# Altium schematic sheet relaytimer.SchDoc
size A; SheetNumber: 1; SheetTotal: 1
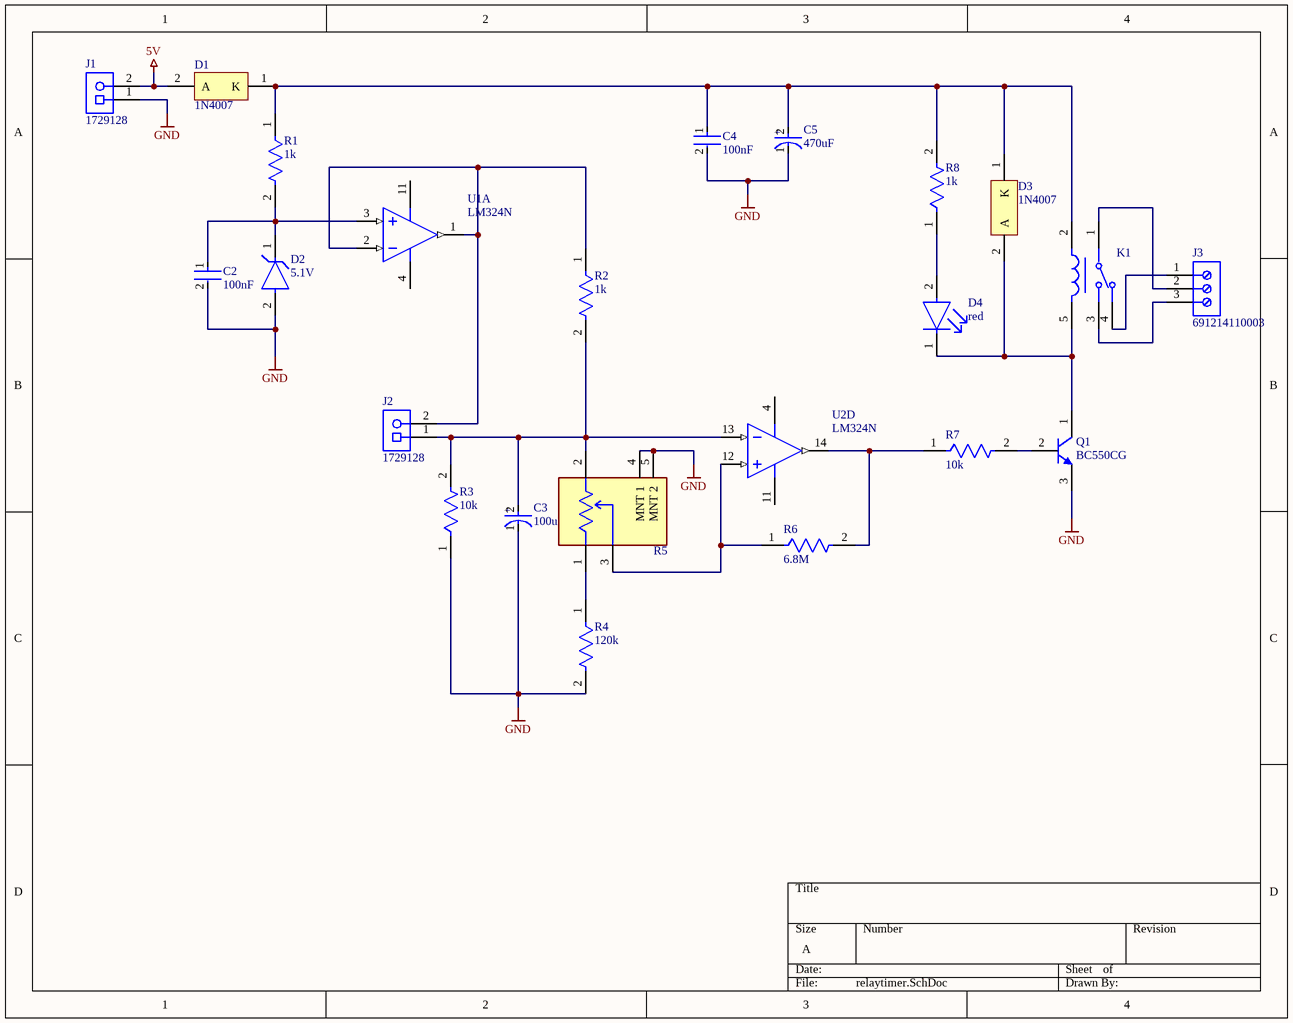
[diagram p0: relaytimer.SchDoc]

## Parts
C2  100nF  [FP-RCE0K1-MFG]
C3  100uF  [FP-OS-CON-TH-C6-d_0_45-MFG]
C4  100nF  [FP-RCE0K1-MFG]
C5  470uF  [FP-OS-CON-TH-C6-d_0_45-MFG]
D1  1N4007  [ONSC-AXIAL_LEAD-2-59-10_P]
D2  5.1V  [FP-017AG-MFG]
D3  1N4007  [ONSC-AXIAL_LEAD-2-59-10_P]
D4  red  [FP-HLMP-1719-MFG]
J1  1729128  [PHOE-1729128-2_V]
J2  1729128  [PHOE-1729128-2_V]
J3  691214110003  [691214110003]
K1  JS1-5V-F  [FP-JS1-5V-F-MFG]  (value not drawn)
Q1  BC550CG  [ONSC-TO-92-3-29-11]
R1  1k  [FP-MRS25-MFG]
R2  1k  [FP-MRS25-MFG]
R3  10k  [FP-MRS25-MFG]
R4  120k  [FP-MRS25-MFG]
R5  PTV09A-4020F-A203  [FP-PTV09A-4020-MFG]  (value not drawn)
R6  6.8M  [FP-MRS25-MFG]
R7  10k  [FP-MRS25-MFG]
R8  1k  [FP-MRS25-MFG]
U1  LM324N  [N0014A]  (part A of 4)
U2  LM324N  [N0014A]  (part D of 4)

## Nets
5V: D1.2(A) J1.2
GND: C2.2 C3.1(C) C4.2 C5.1(C) D2.2(A) J1.1 Q1.3(E) R3.1 R4.2 R5.4(MNT_1) R5.5(MNT_2)
NetC2_1: C2.1 D2.1(C) R1.2 U1.3(IN1+)
NetC3_2: C3.2(A) J2.1 R2.2 R3.2 R5.2 U2.13(IN4-)
NetC4_1: C4.1 C5.2(A) D1.1(K) D3.1(K) K1.2(1_COIL) R1.1 R8.2
NetD3_2: D3.2(A) D4.1(C) K1.5(2_COIL) Q1.1(C)
NetD4_2: D4.2(A) R8.1
NetJ2_2: J2.2 R2.1 U1.1(OUT1) U1.2(IN1-)
NetJ3_1: J3.1 K1.4(N.C.)
NetJ3_2: J3.2 K1.1(COM)
NetJ3_3: J3.3 K1.3(N.O.)
NetQ1_2: Q1.2(B) R7.2
NetR4_1: R4.1 R5.1
NetR5_3: R5.3 R6.1 U2.12(IN4+)
NetR6_2: R6.2 R7.1 U2.14(OUT4)

Not connected (* = marked no-connect by the designer): U1 4(V+) 11(GND); U2 4(V+) 11(GND)

## Notes on the sheet
- (in symbol CMP-05428-000575-1) +

## Library data of the parts
C2 C4 = CMP-06035-058483-1: Cap Ceramic 100nF 50V X7R ±10% Radial 5mm +125°C Automotive Bulk; Lead Diameter: 0.5mm; Lead/Base Style: Formed Leads; Lead Free: Lead Free; Length: 3.6mm; Voltage: 50V; Ratings: AEC-Q200; Termination: Radial; Capacitance: 100nF; Height - Seated (Max): 0.138inch; Voltage Rating: 50V; Voltage Rating (DC): 50V; Height: 3.5mm; Min Operating Temperature: -55°C; Mount: Through Hole; Package Quantity: 500; Depth: 2.5mm; Width: 0.098inch; Lead Pitch: 0.197inch; Dielectric: X7R; Max Operating Temperature: 125°C; Case/Package: Radial; Packaging: Bulk; Tolerance: 10%; Resistor Type: Ceramic
C3 = CMP-05428-000575-1: Conductive Polymer Aluminum Solid Capacitors (OS-CON) 100uF ±20% 16V RADIAL TH 6.3x6mm; Polarity: Polar; Ripple Current: 2.49A; Lead Diameter: 0.45mm; Dissipation Factor: 12%; Life (Hours): 5000Hour; Leakage Current: 280uA; ESR (Equivalent Series Resistance): 24mR; Capacitance: 100uF; Min Operating Temperature: -55°C; Packaging: Bulk; Voltage Rating (DC): 16V; Mount: Through Hole; Number of Pins: 6; Series: OS-CON™, SEPC; Height: 6mm; Radiation Hardening: No; Lead Free: Lead Free; RoHS Compliant: Yes; REACH SVHC: No SVHC; Height - Seated (Max): 0.236inch; Voltage: 16V; Package Quantity: 500; Case/Package: Radial; Lead Pitch: 2.5mm; Diameter: 6.3mm; Tolerance: 20%; Length: 6mm; Construction: RADIAL; Max Operating Temperature: 105°C; Voltage Rating: 16V; Termination: Radial
C5 = CMP-05428-000575-1: Conductive Polymer Aluminum Solid Capacitors (OS-CON) 470uF ±20% 16V RADIAL TH 6.3x6mm; Polarity: Polar; Ripple Current: 2.49A; Lead Diameter: 0.45mm; Dissipation Factor: 12%; Life (Hours): 5000Hour; Leakage Current: 280uA; ESR (Equivalent Series Resistance): 24mR; Capacitance: 470uF; Min Operating Temperature: -55°C; Packaging: Bulk; Voltage Rating (DC): 16V; Mount: Through Hole; Number of Pins: 6; Series: OS-CON™, SEPC; Height: 6mm; Radiation Hardening: No; Lead Free: Lead Free; RoHS Compliant: Yes; REACH SVHC: No SVHC; Height - Seated (Max): 0.236inch; Voltage: 16V; Package Quantity: 500; Case/Package: Radial; Lead Pitch: 2.5mm; Diameter: 6.3mm; Tolerance: 20%; Length: 6mm; Construction: RADIAL; Max Operating Temperature: 105°C; Voltage Rating: 16V; Termination: Radial
D1 D3 = CMP-0902-00142-1: Standard Recovery Rectifier, 2-Pin Axial_Lead, Pb-Free, Bulk Bag; Manufacturer: On Semiconductor; IO(rec) Max (A): 1; IFSM Max (A): 30; VRRM Max (V): 1000; ComponentLink3URL: http://www.onsemi.cn/pub_link/Collateral/59-10.PDF; PackageVersion: Rev. U, 02/2005; PackageDescription: 2-Pin, Axial Lead, Diameter 2.35 mm; PackageReference: AXIAL_LEAD-2-59-10; RoHS: TRUE; PartNumber: 1N4007; Packing: Bulk Bag; DatasheetVersion: Rev. 13; ComponentLink3Description: Package Specification; ComponentLink1Description: Manufacturer URL; ComponentLink2URL: http://www.onsemi.com/pub_link/Collateral/1N4001-D.PDF; ComponentLink1URL: http://www.onsemi.com/; Type: Standard Recovery; ComponentLink2Description: Datasheet; Mounting Technology: Through Hole
D2 = CMP-00278-84409037-1: BZX79C3V3 BZX79C Series 500 mW 5.1 V 100 mA Through Hole Zener Diode - DO-35; Manufacturer Lifecycle Status: ACTIVE; Peak Reverse Current: 25µA; Capacitance: 200pF; Max Junction Temperature (Tj): 200°C; Power Rating: 500mW; Zener Current: 5mA; Forward Voltage: 1.5V; Voltage Tolerance: 5%; Breakdown Voltage: 3.3V; Reverse Voltage: 1V; Element Configuration: Single; Tolerance: 6%; ESD Protection: No; Impedance: 95Ω; REACH SVHC: No SVHC; Schedule B: 8541100050, 8541100050; NexarPartId: 84409037; Weight: 80g; Power Dissipation: 500mW; Max Reverse Leakage Current: 25µA; Length: 4.56mm; Zener Voltage: 3.3V; RoHS: Compliant; Number of Pins: 2; Width: 6.35mm; Lifecycle Status: Production; Height: 1.91mm; Contact Plating: Tin; Diameter: 1.91mm; Max Power Dissipation: 500mW; Test Current: 5mA; Lead Free: Lead Free; Voltage Rating (DC): 3.3V; Max Operating Temperature: 200°C; Mount: Through Hole; Min Operating Temperature: -65°C; Packaging: Bulk; Working Voltage: 3.3V
D4 = CMP-2000-06410-2: LED RED / DIFFUSED T-1 T/H; Manufacturer: Broadcom; Wavelength: 585nm; Led Orientation: Straight; Luminous Intensity: 2.1mcd; Forward Voltage: 1.8V; Viewing Angle: 50°; Colour: Yellow; Description: LED Uni-Color Yellow 2-Pin T-1; Reverse Voltage: 5V; Power Dissipation: 17.5mW; Forward Current: 2mA; Lead Free: Yes; Automotive: No; Device Class L1: Optoelectronics; Mouser Description: Standard LEDs - Through Hole Yellow Diffused 585nm 2.1mcd; Digikey Description: LED YELLOW DIFFUSED T-1 T/H; Temperature: -40°C to +100°C; Temperature Range High: +100°C; Package: 0; Category: Diode; Device Class L2: LEDs; ComponentLink2Description: Datasheet; ComponentLink2URL: https://docs.broadcom.com/docs/AV02-1557EN; Temperature Range Low: -40°C; Device Class L3: unset; Octopart: https://octopart.com/hlmp-1719-broadcom-71130405; RoHS: TRUE; Manufacturer Part Number: HLMP-1719
J1 J2 = CMP-2000-05815-1: PCB Terminal Block, 13.5 A, 400 V, 2-Pin THD, RoHS, Bulk; Manufacturer: Phoenix Contact; Package Version: 03/2015; No. of Rows: 1; Pitch: 5.08mm; No. of Positions: 2; Voltage Rating: 400V; Current Rating: 13500mA; Manufacturer URL: http://www.phoenixcontact.com/; Datasheet URL: https://datasheet.ciiva.com/16046/1729128-16046181.pdf; RoHS: TRUE; Package URL: https://www.phoenixcontact.com/online/portal/pi/pxc/product_detail_page/!ut/p/b1/3VdJjqNKFDxLH8AFycySyWY2ozFsEPOMMQaDOX1XedGL_1Vdm5YXJleknhSKeBkvI6EA8ncAo3AYoDhBQGco6KN7VURTdemj9us_IEKEZo_YHiPAEWEFmDGOHMORkqKYCORBZxgL7ZoaZYcbFFUZ3fqxSY6GOuxydWUuHqz1ynmMFygu583Bob0Ewr6Sd_l-5m-kAueHiB0jpRwZwe58wwtkpxtMYd_LmGcDRU02dRNEyWt6Y2ti5pSyJ_reIkzIulrqApdnbT11V5jnCKbYNCvhEM1MCpPByat_X379-iThf08CI5GfOPqfBeS3BRoBOdD55AKVv0iLwCMq-2BrzXWSGRH7pUGD9uwXQjiph3xL0DKQwdGa0JImiIOmBNOestqgwTHSSs2oOep-78apyXQBvNi8ZLaFjvjWvcaUEBu0MC6Wbe-d6mB0FAebo2lUWinqYaZs5DAYzV0RP9yitUjnGJ0iI9xhZkT42OCQNUJJhkgWINNQLP2JFP6OpMg3JCVg70jqHT0lvKOnhHf0lPuOnnLf0VPuWx6_dxwUIvwk5WMkT0kLL1mh61l2yZVSzG3pYV_bqo-mj6uMKwKwdnnW8Jh5RTOJzMOA5c-eJDaZQw4mTMPH02PvS_ZAqNVjVTo2WyYLkwH_KU1mmmG5kjRhDqPXLwwVHvVOjCM60-fpXvTDfMGW1PVFVS1r4e4yVDk4ZdNbkUHvqPqQSeian4UD39fNKmachqdJ1NJbyk8rXT9mXTvPk3oE5meulKGgiruPJek-4I9hTT6G8ZLOyRSm2RRVbThERQad5OS28hdt4YW4vG0stgYYzsWsK4_7y6DZMjJSCqri1kyiZR5vD7pwIrNR7QwPHTcLTI5qT7eRlpHrdGiupYlqQDJ7zy_CND8fWWBoLRXxk1RVcXiBQwbTD4Xi7KL-FuO94t9xaqweXzH; PartNumber: 1729128; Package Description: 2-Pin Through Hole Device, Body 8.1 x 10.16 mm, Pitch 5.08 mm; Datasheet Version: 12/2013; Mounting Technology: ThroughHole; Orientation: Horizontal; Package Reference: 1729128-2; Packing: Bulk
J3 = CMP-1502-02466-2: NexarPartId: 18818289; Number of Levels: 1; Voltage: 300V; Pitch: 3.5052mm; Stripping Length: -6mm; Number of Positions Per Level: 3; Plating: Brass, Steel; Wire/Cable Gauge: 24AWG; Wire Gauge (Min): 16AWG; Current Rating: 10A; Width: 10.9mm; Length: 7.4mm; Housing Material: Nylon; Height: 12.2mm; Min Operating Temperature: -40°C; Contact Plating: Brass, Tin; Packaging: Box; Color: Blue, Green; Number of Contacts: 3; Number of Pins: 3; Voltage Rating: 300V; Termination: Screw; Lead Pitch: 3.5mm; Max Operating Temperature: 105°C; Mount: Through Hole; Contact Material: Brass; RoHS: Compliant; Wire Gauge (Max): 24AWG; Current: 10A; REACH SVHC: Unknown
K1 = CMP-05606-000016-1: RELAY GEN PURPOSE SPDT 10A 5V; Manufacturer: Panasonic; Coil Type: Non-Latching; Number Of Contacts: 1; Standoff Height: 0.3mm; Switching Power: 150W; Coil Power: 360mW; Coil Current: 72mA; Coil Resistance: 69.4Ω; Lead Free: Yes; Device Class L3: Power Relays; Device Class L1: Electromechanical; Ambient Temperature Range High: +70°C; Temperature: -40°C to +70°C; Temperature Range High: +70°C; Temperature Range Low: -40°C; Manufacturer Part Number: JS1-5V-F; Coil Voltage: 5V; Switching Current: 10A; Digikey Description: RELAY GEN PURPOSE SPDT 10A 5V; Device Class L2: Relays; Ambient Temperature Range Low: -40°C; Throw Configuration: SPDT; Category: Relay; ComponentLink2URL: https://www3.panasonic.biz/ac/e_download/control/relay/power/catalog/mech_eng_js.pdf?via=ok; Package: JS1-5V-F; Octopart: https://octopart.com/js1-5v-f-panasonic-39428621; Mouser Description: JS Series 10 A SPDT 5 V Through Hole Sealed Miniature Non-Polarized Power Relay; Height: 16.8mm; ComponentLink2Description: Datasheet; RoHS: TRUE; Automotive: No
Q1 = CMP-1048-01461-1: Low Noise Transistor, NPN Silicon, 3-Pin TO-92, Pb-Free, Bulk Box; Manufacturer: On Semiconductor; IC Continuous (A): 0.1; ComponentLink1URL: http://www.onsemi.com/; DatasheetVersion: Rev. 2; ComponentLink1Description: Manufacturer URL; Mounting Technology: Through Hole; PackageVersion: Rev. AM; PackageReference: TO-92-3-29-11_AM_SL; PackageDescription: 3-Pin Transistor Outline, Body 4.825 x 3.685 mm, Pitch 1.27 mm; PartNumber: BC550CG; ComponentLink2Description: Datasheet; ComponentLink3Description: Package Specification; ComponentLink3URL: http://www.onsemi.cn/pub_link/Collateral/2N6426-D.PDF; RoHS: TRUE; Packing: Bulk Box; ComponentLink2URL: http://www.onsemi.com/pub_link/Collateral/BC550C-D.PDF; Polarity: NPN
R1-R4 R6-R8 = CMP-00030-42757237-1: MRS25000C1000FRP00 Resistor, 1000 Ohm, ± 1%, 600 mW, Axial Leaded, Metal Film (Thin Film), Professional; Max Power Dissipation: 600mW; Resistance: 1kΩ; Voltage Rating: 350V; Temperature Coefficient: 50ppm/°C; Lead Diameter: 600µm; RoHS: Compliant; Radiation Hardening: No; Schedule B: 8533210090, 8533210090; Length: 6.5mm; Packaging: Tape & Reel (TR); Number of Terminations: 2; Mount: Through Hole; Width: 2.5mm; Tolerance: 1%; Military Standard: Not; Voltage Rating (DC): 350V; Contact Plating: Tin; Number of Pins: 2; Max Operating Temperature: 155°C; NexarPartId: 42757237; Diameter: 2.5mm; Composition: Metal Film, Thin Film; REACH SVHC: Unknown; Power Rating: 600mW; Lead Free: Lead Free; Termination: Axial; Case/Package: Axial; Min Operating Temperature: -55°C
R5 = CMP-07234-000017-1: POT 20K OHM 1/20W CARBON LOG; Manufacturer: Bourns Inc.; Tolerance: 20%; Voltage Rating: 50V; Description: 20k Ohm 1 Gang Logarithmic Through Hole, Snap In Potentiometer None 1 Kierros Carbon 0.05W, 1/20W PC Pins, Board Locks; Power Rating: 0.05W; Resistance: 20kΩ; Value: 20kΩ; Series: PTV09; Device Class L1: Passive Components; Mouser Description: Potentiometers 20K AUDIO 20%; Device Class L3: Variable Resistors and Potentiometers; Lead Free: Yes; Package: PTV09A-4020; ComponentLink2URL: https://www.bourns.com/docs/product-datasheets/ptv09.pdf?sfvrsn=5e1089f1_12; Octopart: https://octopart.com/ptv09a-4020f-a203-bourns-1637636; Temperature: -10°C to +50°C; Height: 20.5mm; ComponentLink2Description: Datasheet; Category: Res; Digikey Description: POT 20K OHM 1/20W CARBON LOG; Temperature Range High: +50°C; RoHS: TRUE; Device Class L2: Resistors; Composition: Carbon; Automotive: No; Manufacturer Part Number: PTV09A-4020F-A203; Temperature Range Low: -10°C
U1 U2 = CMP-0055-00082-3: Low Power Quad Operational Amplifier, 14-pin MDIP; Manufacturer: Texas Instruments; CompType: Amplifiers; PowerWise: N; PackageTopMarking: NSUZXYYTTE#*LM324N; PackageDescription: MDIP, .750 x .250 x.130in, 14 Lead, .100in Pitch; Package Reference: N0014A; RoHS: N; Code_JEDEC: MS-001-AA; ComponentLink1URL: http://www.ti.com/general/docs/lit/getliterature.tsp?genericPartNumber=LM324&fileType=pdf; ComponentLink1Description: Datasheet URL; PinCount: 14